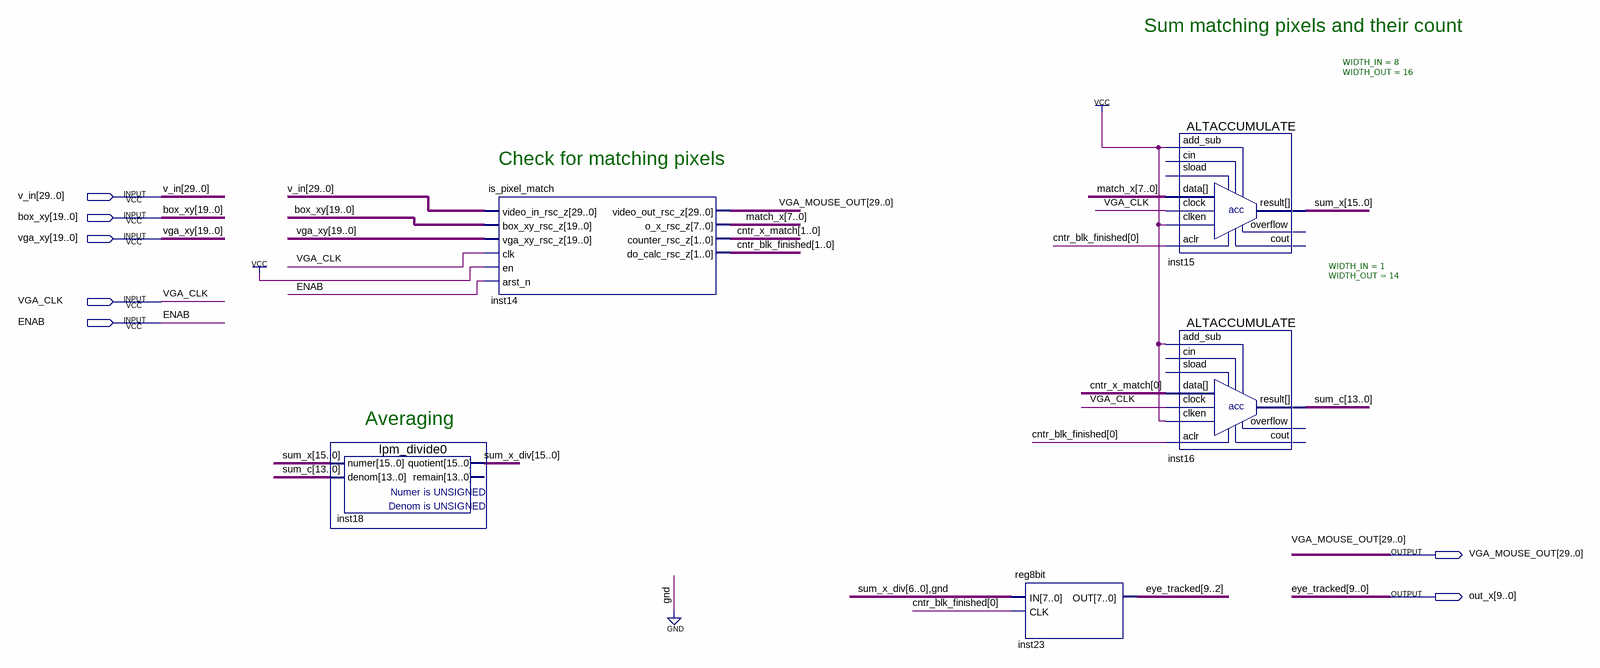
[diagram p0: schematic sheet]
// Quartus schematic track_n_average.bdf as structural Verilog: 5 symbols, 7 pins
module track_n_average (
  input  [29:0] v_in,
  input  [19:0] box_xy,
  input  [19:0] vga_xy,
  input  VGA_CLK,
  input  ENAB,
  output [29:0] VGA_MOUSE_OUT,
  output [9:0] out_x
);

  wire [1:0] cntr_blk_finished, cntr_x_match;
  wire [7:0] match_x;
  wire [13:0] sum_c;
  wire [15:0] sum_x, sum_x_div;

  lpm_divide0 inst18 (.numer(sum_x), .denom(sum_c), .quotient(sum_x_div));  // open: remain
  is_pixel_match inst14 (
    .video_in_rsc_z(v_in), .box_xy_rsc_z(box_xy), .vga_xy_rsc_z(vga_xy), .clk(VGA_CLK), .en(1'b1),
    .arst_n(ENAB), .video_out_rsc_z(VGA_MOUSE_OUT), .o_x_rsc_z(match_x), .counter_rsc_z(cntr_x_match),
    .do_calc_rsc_z(cntr_blk_finished));
  reg8bit inst23 (.IN({sum_x_div[6:0], 1'b0}), .CLK(cntr_blk_finished[0]), .OUT(out_x[9:2]));
  ALTACCUMULATE #(.WIDTH_IN(8), .WIDTH_OUT(16)) inst15 (
    .add_sub(1'b1), .aclr(cntr_blk_finished[0]), .clock(VGA_CLK), .clken(1'b1), .data(match_x), .result(sum_x));  // open: cin, sload, cout, overflow
  ALTACCUMULATE #(.WIDTH_IN(1), .WIDTH_OUT(14)) inst16 (
    .add_sub(1'b1), .aclr(cntr_blk_finished[0]), .clock(VGA_CLK), .clken(1'b1), .data(cntr_x_match[0]),
    .result(sum_c));  // open: cin, sload, cout, overflow

  // Other names for the same wires on the sheet: eye_tracked[9:0] = out_x

  // Notes on the sheet:
  //   Sum matching pixels and their count
  //   Check for matching pixels
  //   Averaging
endmodule
